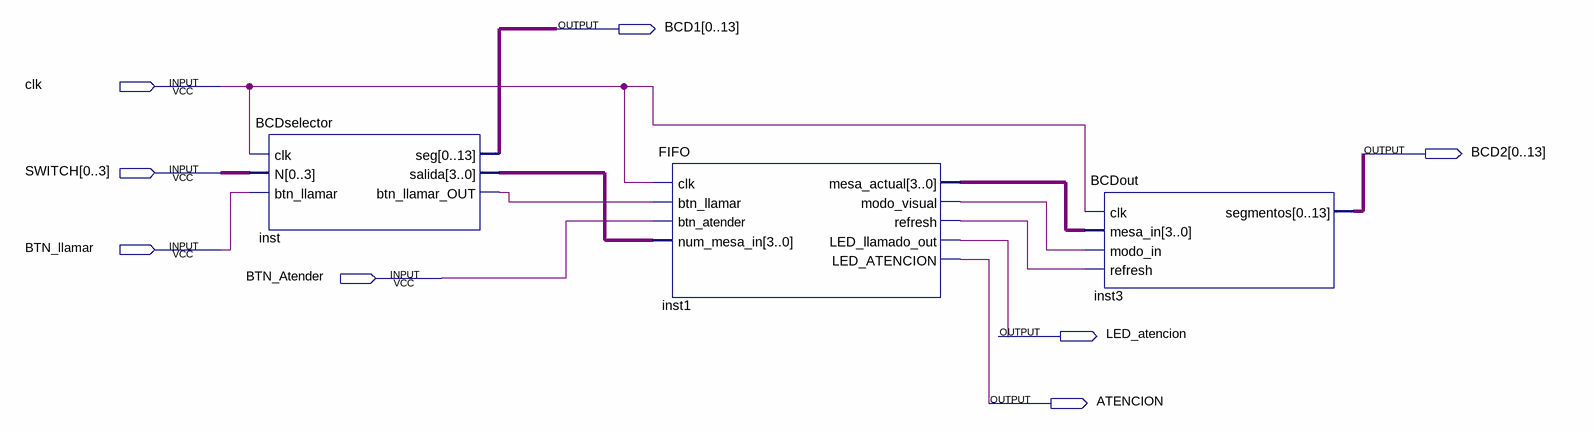
[diagram p0: schematic sheet]
// Quartus schematic sistema.bdf as structural Verilog: 3 symbols, 8 pins
module sistema (
  input  clk,
  input  [0:3] SWITCH,
  input  BTN_llamar,
  input  BTN_Atender,
  output [0:13] BCD1,
  output [0:13] BCD2,
  output LED_atencion,
  output ATENCION
);

  wire inst1_modo_visual, inst1_refresh, inst_btn_llamar_out;
  wire [3:0] inst1_mesa_actual, inst_salida;

  BCDselector inst (
    .clk(clk), .N(SWITCH), .btn_llamar(BTN_llamar), .seg(BCD1), .salida(inst_salida),
    .btn_llamar_OUT(inst_btn_llamar_out));
  FIFO inst1 (
    .clk(clk), .btn_llamar(inst_btn_llamar_out), .btn_atender(BTN_Atender), .num_mesa_in(inst_salida),
    .mesa_actual(inst1_mesa_actual), .modo_visual(inst1_modo_visual), .refresh(inst1_refresh),
    .LED_llamado_out(LED_atencion), .LED_ATENCION(ATENCION));
  BCDout inst3 (
    .clk(clk), .mesa_in(inst1_mesa_actual), .modo_in(inst1_modo_visual), .refresh(inst1_refresh),
    .segmentos(BCD2));
endmodule
